# EAGLE schematic Koala_Bear_test_jig (EAGLE 6.5.0)
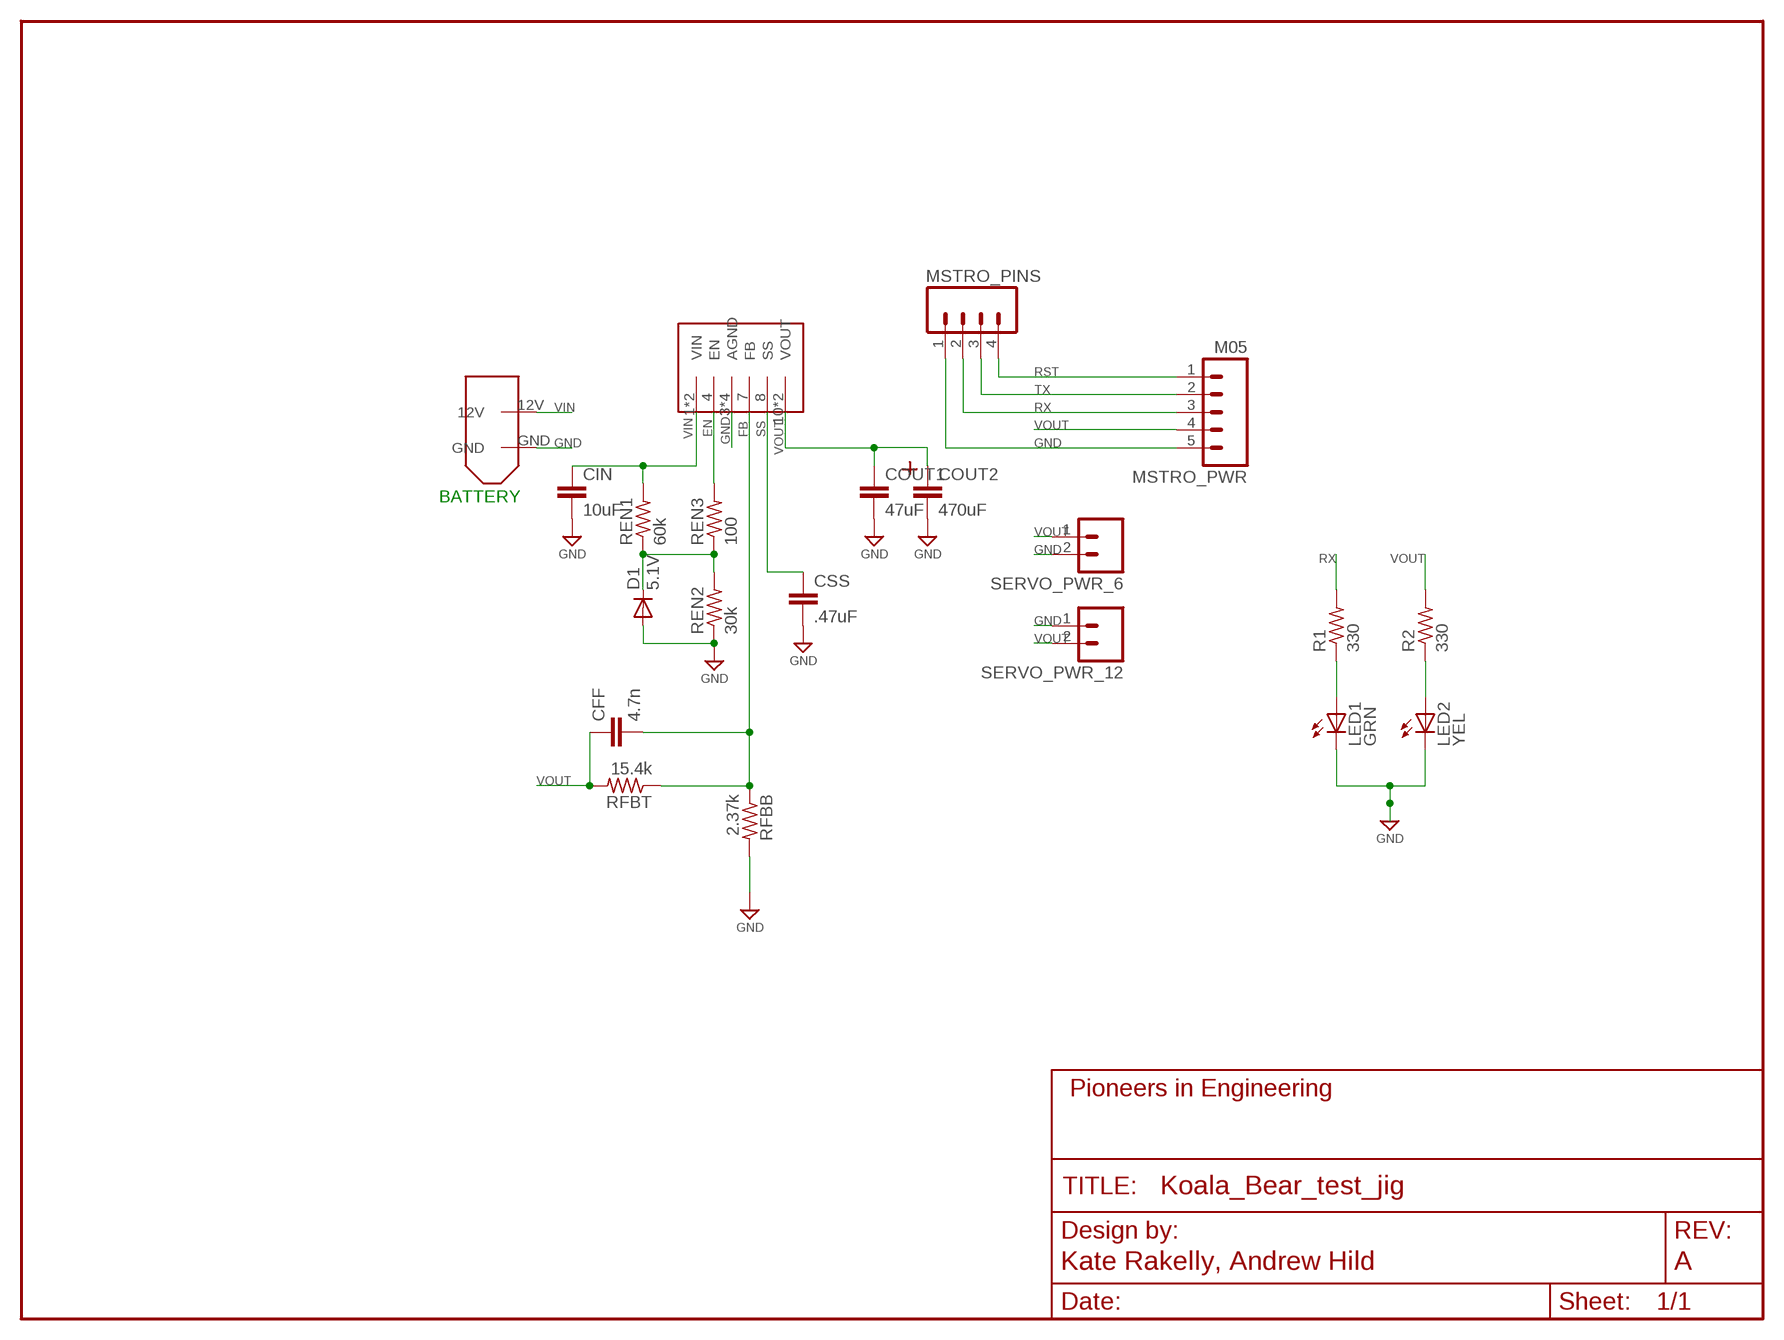
[diagram p0: schematic, sheet 1]
FRAME1 (FRAME-LETTER): AUTHOR: Kate Rakelly, Andrew Hild; REVISION: A

## Parts
CFF  4.7n  CAP0603-CAP  [0603-CAP]
CIN  10uF  CAP0603-CAP  [0603-CAP]
COUT1  47uF  CAP1206  [1206]
COUT2  470uF  TANT_CASE_E  [TANT_CASE_E]
CSS  .47uF  CAP0603-CAP  [0603-CAP]
D1  5.1V  DIODESOD  [SOD-323]
LED1  GRN  LEDCHIP-LED0805  [CHIP-LED0805]
LED2  YEL  LEDCHIP-LED0805  [CHIP-LED0805]
MSTRO_PINS  M041X04-MTA  [1X04-MTA]
MSTRO_PWR  M05  [1X05-MTA]
R1  330  R-US_R0603  [R0603]
R2  330  R-US_R0603  [R0603]
REN1  60k  R-US_R0603  [R0603]
REN2  30k  R-US_R0603  [R0603]
REN3  100  R-US_R0603  [R0603]
RFBB  2.37k  R-US_R0603  [R0603]
RFBT  15.4k  R-US_R0603  [R0603]
SERVO_PWR_6  M02PTH  [1X02]
SERVO_PWR_12  M02PTH  [1X02]
U$1  LMZ12010  [LMZ12010]
XT60  XT60CONNECTOR  [XT60CONNECTOR]

## Nets
DIODE: D1.1(C) REN1.1 REN2.2 REN3.1
EN: REN3.2 U$1.4(EN)
FB: CFF.2 RFBB.1 RFBT.1 U$1.7(FB)
GND: CIN.2 COUT1.2 COUT2.NEG CSS.2 D1.2(A) LED1.C LED2.C MSTRO_PINS.1 MSTRO_PWR.5 REN2.1 RFBB.2 SERVO_PWR_6.2 SERVO_PWR_12.1 U$1.3(AGND) U$1.5(AGND) U$1.6(AGND) U$1.GND(AGND) XT60.GND
N$1: LED1.A R1.1
N$5: LED2.A R2.1
RST: MSTRO_PINS.4 MSTRO_PWR.1
RX: MSTRO_PINS.2 MSTRO_PWR.3 R1.2
SS: CSS.1 U$1.8(SS)
TX: MSTRO_PINS.3 MSTRO_PWR.2
VIN: CIN.1 REN1.2 U$1.1(VIN) U$1.2(VIN) XT60.12V
VOUT: CFF.1 COUT1.1 COUT2.POS MSTRO_PWR.4 R2.2 RFBT.2 SERVO_PWR_6.1 SERVO_PWR_12.2 U$1.10(VOUT) U$1.11(VOUT)

## Notes on the sheet
- BATTERY

## Library data of the parts
CFF CIN CSS = pie:CAP: Capacitor Standard 0603 ceramic capacitor, and 0.1" leaded capacitor.
COUT1 = SparkFun:CAP: Capacitor Standard 0603 ceramic capacitor, and 0.1" leaded capacitor.
COUT2 = TANT_CASE_E:TANT_CASE_E
D1 = SparkFun:DIODE: Diode These are standard reverse protection diodes and small signal diodes. SMA package can handle up to about 1A. SOD-323 can handle about 200mA. What the SOD-323 package when ordering, there are some mfgs out there that are 5-pin packages.
LED1 LED2 = led:LED: LED OSRAM: - CHIPLED LG R971, LG N971, LY N971, LG Q971, LY Q971, LO R971, LY R971 LH N974, LH R974 LS Q976, LO Q976, LY Q976 LO Q996 - Hyper CHIPLED LW Q18S LB Q993, LB Q99A, LB R99A - SideLED LS A670, LO A670, LY A670, LG A670, LP A670 LB A673, LV A673, LT A673, LW A673 LH A674 LY A675 LS A676, LA A676, LO A676, LY A676, LW A676 LS A679, LY A679, LG A679 - Hyper Micro SIDELED® LS Y876, LA Y876, LO Y876, LY Y876 LT Y87S - SmartLED LW L88C, LW L88S LB L89C, LB L89S, LG L890 LS L89K, LO L89K, LY L89K LS L896, LA L896, LO L896, LY L896 - TOPLED LS T670, LO T670, LY T670, LG T670, LP T670 LSG T670, LSP T670, LSY T670, LOP T670, LYG T670 LG T671, LOG T671, LSG T671 LB T673, LV T673, LT T673, LW T673 LH T674 LS T676, LA T676, LO T676, LY T676, LB T676, LH T676, LSB T676, LW T676 LB T67C, LV T67C, LT T67C, LS T67K, LO T67K, LY T67K, LW E67C LS E67B, LA E67B, LO E67B, LY E67B, LB E67C, LV E67C, LT E67C LW T67C LS T679, LY T679, LG T679 LS T770, LO T770, LY T770, LG T770, LP T770 LB T773, LV T773, LT T773, LW T773 LH T774 LS E675, LA E675, LY E675, LS T675 LS T776, LA T776, LO T776, LY T776, LB T776 LHGB T686 LT T68C, LB T68C - Hyper Mini TOPLED® LB M676 - Mini TOPLED Santana® LG M470 LS M47K, LO M47K, LY M47K Source: http://www.osram.convergy.de LUXEON: - LUMILED® LXK2-PW12-R00, LXK2-PW12-S00, LXK2-PW14-U00, LXK2-PW14-V00 LXK2-PM12-R00, LXK2-PM12-S00, LXK2-PM14-U00 LXK2-PE12-Q00, LXK2-PE12-R00, LXK2-PE12-S00, LXK2-PE14-T00, LXK2-PE14-U00 LXK2-PB12-K00, LXK2-PB12-L00, LXK2-PB12-M00, LXK2-PB14-N00, LXK2-PB14-P00, LXK2-PB14-Q00 LXK2-PR12-L00, LXK2-PR12-M00, LXK2-PR14-Q00, LXK2-PR14-R00 LXK2-PD12-Q00, LXK2-PD12-R00, LXK2-PD12-S00 LXK2-PH12-R00, LXK2-PH12-S00 LXK2-PL12-P00, LXK2-PL12-Q00, LXK2-PL12-R00 Source: www.luxeon.com KINGBRIGHT: KA-3528ASYC Source: www.kingbright.com
MSTRO_PINS = pie_new:M04: Header 4 Standard 4-pin 0.1" header. Use with straight break away headers (SKU : PRT-00116), right angle break away headers (PRT-00553), swiss pins (PRT-00743), machine pins (PRT-00117), and female headers (PRT-00115). Molex polarized connector foot print use with SKU : PRT-08231 with associated crimp pins and housings. 1MM SMD Version SKU: PRT-10208; PARTNUMBER: A1922-ND
MSTRO_PWR = pie:M05
R1 R2 = rcl:R-US_: RESISTOR, American symbol
REN1-REN3 RFBB RFBT = pie:R-US_: RESISTOR, American symbol
SERVO_PWR_6 SERVO_PWR_12 = pie:M02: Header 2 Standard 2-pin 0.1" header. Use with straight break away headers (SKU : PRT-00116), right angle break away headers (PRT-00553), swiss pins (PRT-00743), machine pins (PRT-00117), and female headers (PRT-00115). Molex polarized connector foot print use with SKU : PRT-08233 with associated crimp pins and housings.
U$1 = LMZ12010:LMZ12010
XT60 = pie_new:XT60CONNECTOR: 12V XT60 power connector; PARTNUMBER: PRT-10474